# Altium schematic sheet 魔方主板.SchDoc
size A3
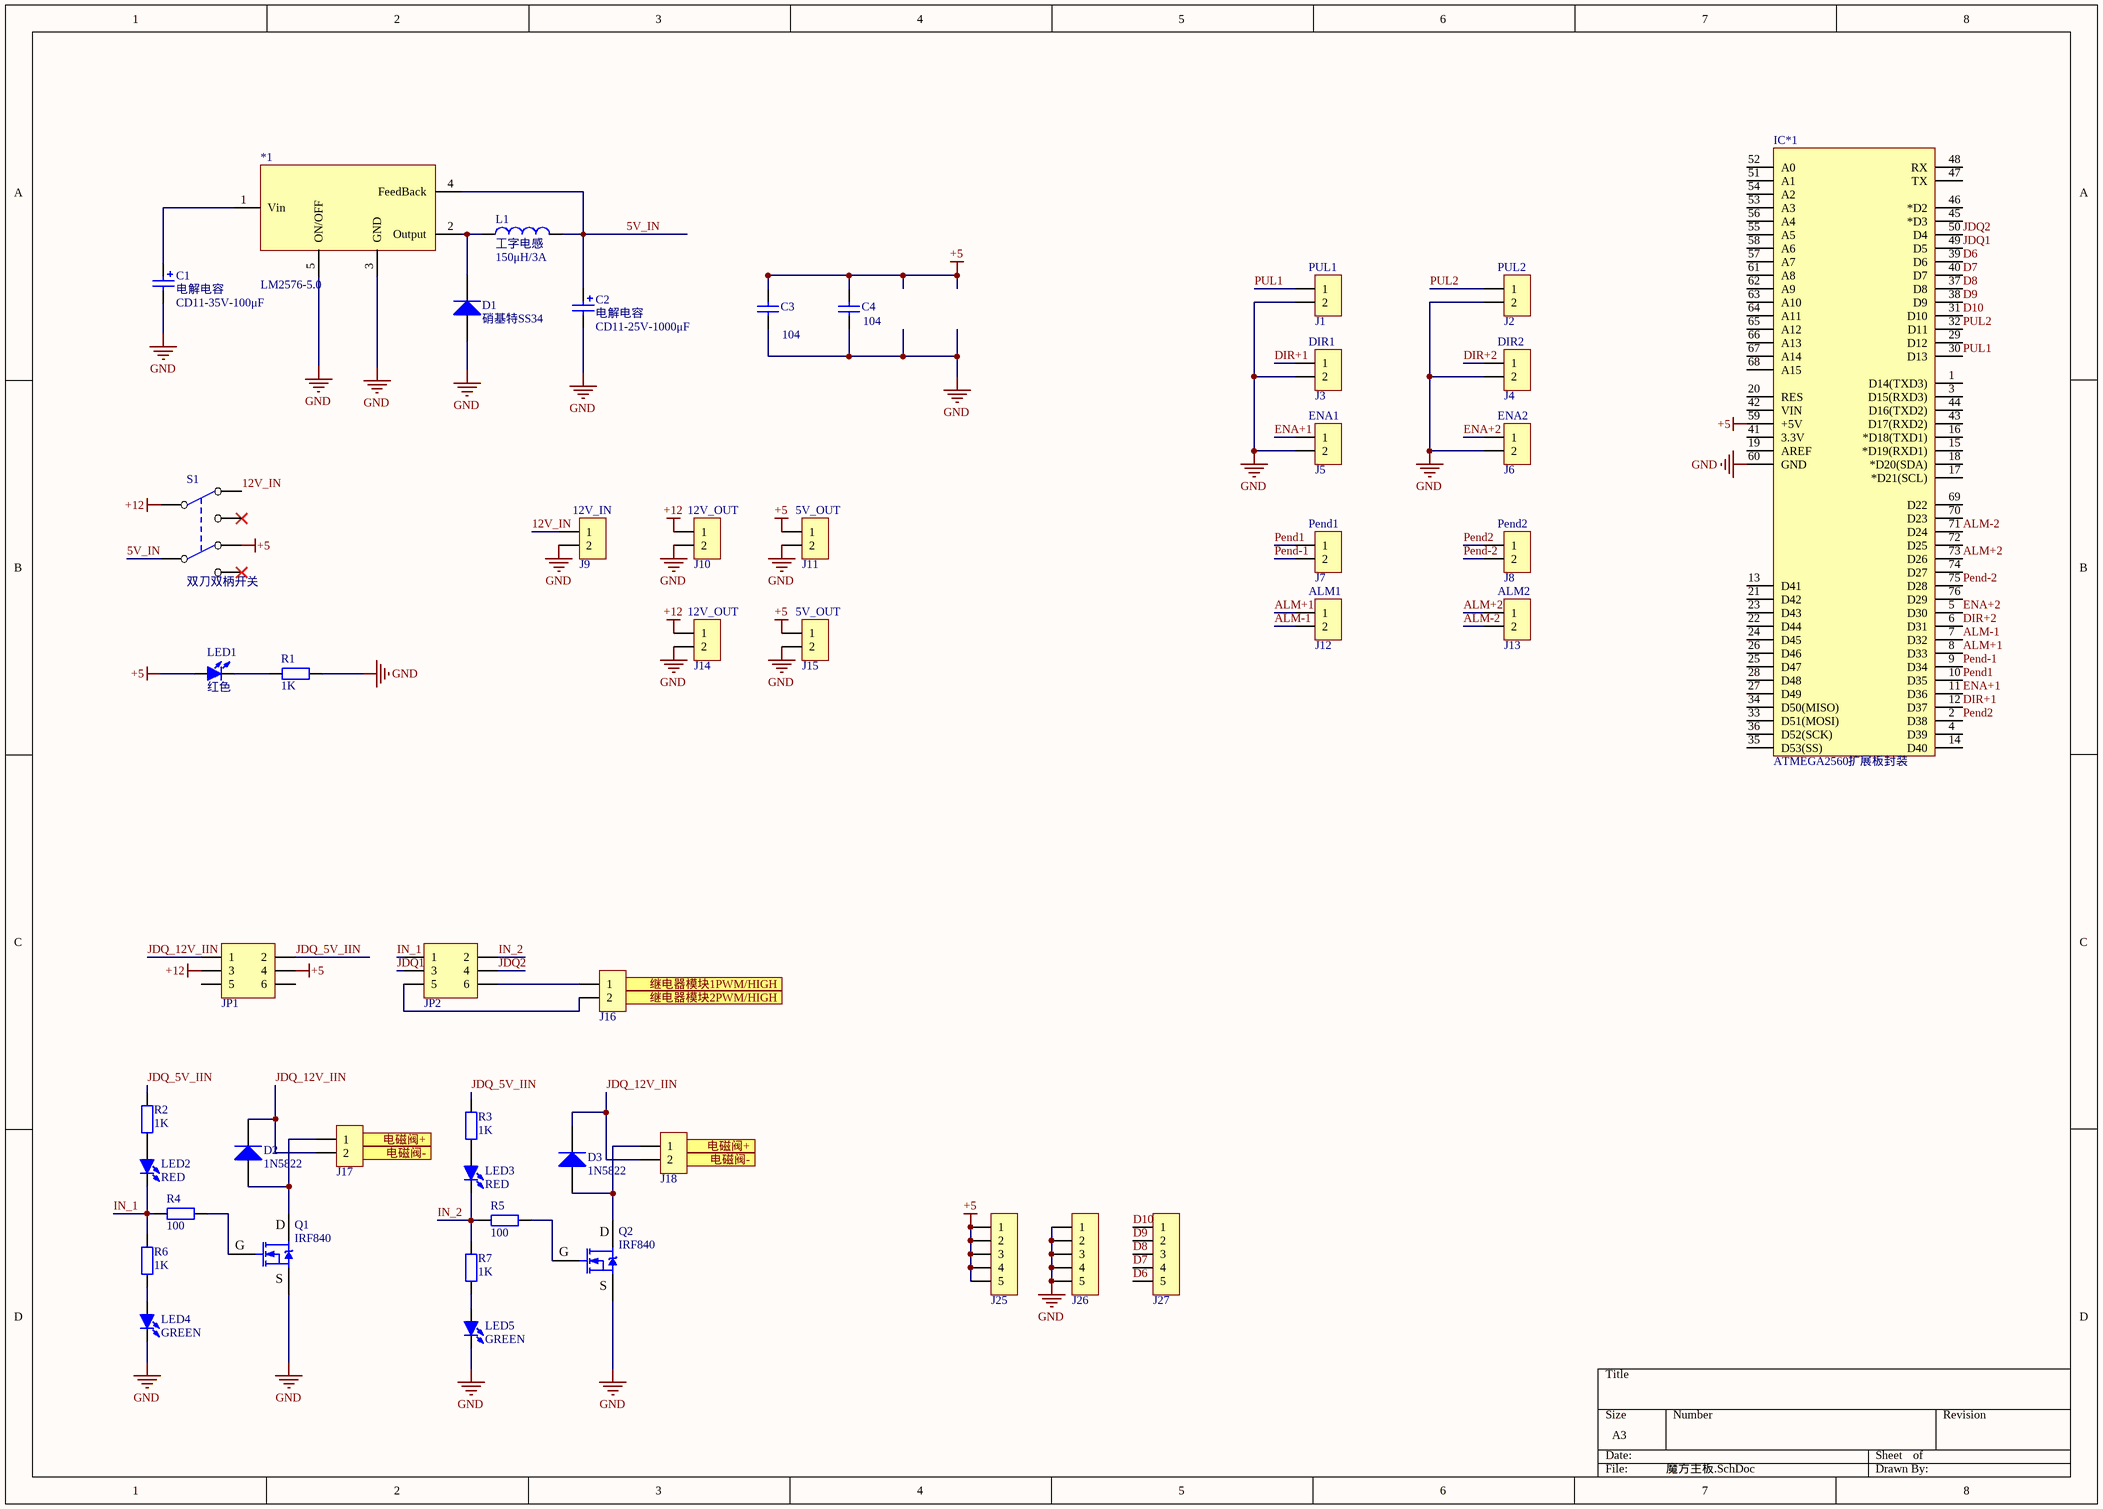
[diagram p0: 魔方主板.SchDoc]

## Parts
*1  LM2576-5.0  [TO263-5]
C1  电解电容  value CD11-35V-100μF  [CAP 3.5*8*11.5 - BK]
C2  电解电容  value CD11-25V-1000μF  [CAP 3.5*8*11.5]
C3  value 104  [C 0805_M]  (hidden comment: 104贴片电容)
C4  value 104  [C 0805_M]  (hidden comment: 104贴片电容)
D1  硝基特SS34  [SMB]
D2  1N5822  [DO-201AD]
D3  1N5822  [DO-201AD]
IC*1  ATMEGA2560扩展板封装  [ATMEGA2560扩展板封装]
J1  PUL1  [KF128-5.08-2P]
J2  PUL2  [KF128-5.08-2P]
J3  DIR1  [KF128-5.08-2P]
J4  DIR2  [KF128-5.08-2P]
J5  ENA1  [KF128-5.08-2P]
J6  ENA2  [KF128-5.08-2P]
J7  Pend1  [KF128-5.08-2P]
J8  Pend2  [KF128-5.08-2P]
J9  12V_IN  [KF128-5.08-2P]
J10  12V_OUT  [KF128-5.08-2P]
J11  5V_OUT  [KF128-5.08-2P]
J12  ALM1  [KF128-5.08-2P]
J13  ALM2  [KF128-5.08-2P]
J14  12V_OUT  [KF128-5.08-2P]
J15  5V_OUT  [KF128-5.08-2P]
J16  HDR-1X2  [KF128-5.08-2P]  (value not drawn)
J17  HDR-1X2  [KF128-5.08-2P]  (value not drawn)
J18  HDR-1X2  [KF128-5.08-2P]  (value not drawn)
J25  HDR-1X5  [HDR2.54-LI-5P]  (value not drawn)
J26  HDR-1X5  [HDR2.54-LI-5P]  (value not drawn)
J27  HDR-1X5  [HDR2.54-LI-5P]  (value not drawn)
JP1  Header3X2  [HDR2.54-LI-2x3P]  (value not drawn)
JP2  Header3X2  [HDR2.54-LI-2x3P]  (value not drawn)
L1  工字电感  value 150μH/3A  [PK0810]
LED1  红色  [LED 0805R]
LED2  RED  [LED 0805R]
LED3  RED  [LED 0805R]
LED4  GREEN  [LED 0805R]
LED5  GREEN  [LED 0805R]
Q1  IRF840  [TO220A]
Q2  IRF840  [TO220A]
R1  1K  [R 0805_M]
R2  1K  [R 0805_M]
R3  1K  [R 0805_M]
R4  100  [R 0805_M]
R5  100  [R 0805_M]
R6  1K  [R 0805_M]
R7  1K  [R 0805_M]
S1  双刀双柄开关  [双船开关]

## Ports
电磁阀+, 电磁阀-, 继电器模块1PWM/HIGH, 继电器模块2PWM/HIGH

## Nets
+5: C3.1 C4.1 IC*1.59(+5V) J11.1 J15.1 J25.1 J25.2 J25.3 J25.4 J25.5 JP1.4 LED1.1(A) S1.4(NC2)
+12: J10.1 J14.1 JP1.3 S1.1(COMMON1)
GND: *1.3(GND) *1.5(ON/OFF) C1.2 C2.2 C3.2 C4.2 D1.1(A) IC*1.60(GND) J1.2 J2.2 J3.2 J4.2 J5.2 J6.2 J9.2 J10.2 J11.2 J14.2 J15.2 J26.1 J26.2 J26.3 J26.4 J26.5 LED4.2(K) LED5.2(K) Q1.3(S) Q2.3(S) R1.1
5V_IN: *1.4(FeedBack) C2.1 L1.2 S1.5(COMMON2)
12V_IN: J9.1 S1.2(NC1)
ALM+1: IC*1.8(D33) J12.1
ALM+2: IC*1.73(D26) J13.1
ALM-1: IC*1.7(D32) J12.2
ALM-2: IC*1.71(D24) J13.2
D6: IC*1.39(D6) J27.5
D7: IC*1.40(D7) J27.4
D8: IC*1.37(D8) J27.3
D9: IC*1.38(D9) J27.2
D10: IC*1.31(D10) J27.1
DIR+1: IC*1.12(D37) J3.1
DIR+2: IC*1.6(D31) J4.1
ENA+1: IC*1.11(D36) J5.1
ENA+2: IC*1.5(D30) J6.1
IN_1: JP2.1 LED2.2(K) R4.2 R6.2
IN_2: JP2.2 LED3.2(K) R5.2 R7.2
JDQ1: IC*1.49(D5) JP2.3
JDQ2: IC*1.50(D4) JP2.4
JDQ_5V_IIN: JP1.2 R2.2 R3.2
JDQ_12V_IIN: D2.2(K) D3.2(K) J17.2 J18.2 JP1.1
Pend1: IC*1.10(D35) J7.1
Pend2: IC*1.2(D38) J8.1
Pend-1: IC*1.9(D34) J7.2
Pend-2: IC*1.75(D28) J8.2
PUL1: IC*1.30(D13) J1.1
PUL2: IC*1.32(D11) J2.1
Net*1_1: *1.1(Vin) C1.1
Net*1_2: *1.2(Output) D1.2(K) L1.1
NetD2_1: D2.1(A) J17.1 Q1.2(D)
NetD3_1: D3.1(A) J18.1 Q2.2(D)
NetJ16_1: J16.1 JP2.6
NetJ16_2: J16.2 JP2.5
NetLED1_2: LED1.2(K) R1.2
NetLED2_1: LED2.1(A) R2.1
NetLED3_1: LED3.1(A) R3.1
NetLED4_1: LED4.1(A) R6.1
NetLED5_1: LED5.1(A) R7.1
NetQ1_1: Q1.1(G) R4.1
NetQ2_1: Q2.1(G) R5.1

Not connected (* = marked no-connect by the designer): IC*1 1(D14(TXD3)) 3(D15(RXD3)) 4(D39) 13(D41) 14(D40) 15(*D19(RXD1)) 16(*D18(TXD1)) 17(*D21(SCL)) 18(*D20(SDA)) 19(AREF) 20(RES) 21(D42) 22(D44) 23(D43) 24(D45) 25(D47) 26(D46) 27(D49) 28(D48) 29(D12) 33(D51(MOSI)) 34(D50(MISO)) 35(D53(SS)) 36(D52(SCK)) 41(3.3V) 42(VIN) 43(D17(RXD2)) 44(D16(TXD2)) 45(*D3) 46(*D2) 47(TX) 48(RX) 51(A1) 52(A0) 53(A3) 54(A2) 55(A5) 56(A4) 57(A7) 58(A6) 61(A8) 62(A9) 63(A10) 64(A11) 65(A12) 66(A13) 67(A14) 68(A15) 69(D22) 70(D23) 72(D25) 74(D27) 76(D29); JP1 5 6; S1 3(NO1)* 6(NO2)*

## Library data of the parts
*1 = LM2576HV-5.0
C1 C2 = Cap Pol2: Polarized Capacitor (Axial); Published: 8-Jun-2000; LatestRevisionDate: 17-Jul-2002; LatestRevisionNote: Re-released for DXP Platform.; PackageReference: POLAR0.8; Publisher: Altium Limited; PackageDescription: Polarized Capacitor; 2 Leads
C3 C4 = Cap Semi: Capacitor (Semiconductor SIM Model); Published: 8-Jun-2000; LatestRevisionDate: 29-May-2009; LatestRevisionNote: IPC-7351 Footprint Added.; PackageReference: C1206; Publisher: Altium Limited; PackageDescription: Chip Capacitor
D1-D3 = Diode 1N5408: 3 Amp Medium Power Silicon Rectifier Diode; Published: 8-Jun-2000; LatestRevisionDate: 17-Jul-2002; LatestRevisionNote: Re-released for DXP Platform.; DatasheetVersion: Aug-1984; PackageReference: DO-201AD; Publisher: Altium Limited; PackageDescription: Diode, Axial; Body 9.5 x 5.3 mm (LxDia. max), Lead Dia. 1.32 mm (max); ComponentLink1Description: Manufacturer Link; ComponentLink1URL: http://www.irf.com/
J1-J18 = Header 2: 2P接插件; 版权归属: 源创客; BOM名称: 2P接插件; 学习资源: www.ooocke.com
J25-J27 = Header 5: 5P接插件; 版权归属: 源创客; BOM名称: 5P接插件; 学习资源: www.ooocke.com
JP1 JP2 = Header 3X2: 3*2P接插件; 版权归属: 源创客; BOM名称: 3*2P接插件; 学习资源: www.ooocke.com
L1 = Inductor: Code_IEC: 1005; Published: 8-Jun-2000; LatestRevisionDate: 29-May-2009; LatestRevisionNote: IPC-7351 Footprint Added.; PackageReference: 0402-A; Publisher: Altium Limited; PackageDescription: Chip Inductor; Code_JEITA: 0402
LED1-LED5 = LED-SMD: 贴片LED; 版权归属: 源创客; BOM名称: 贴片LED; 学习资源: www.ooocke.com
Q1 Q2 = IRF840: N沟场效应管; 版权归属: 源创客; BOM名称: N沟场效应管; 学习资源: www.ooocke.com
R1-R7 = R: 贴片电阻; 版权归属: 源创客; BOM名称: 贴片电阻; 学习资源: www.ooocke.com